# EAGLE design pcb-bldc-sensorless (EAGLE 9.6.2)
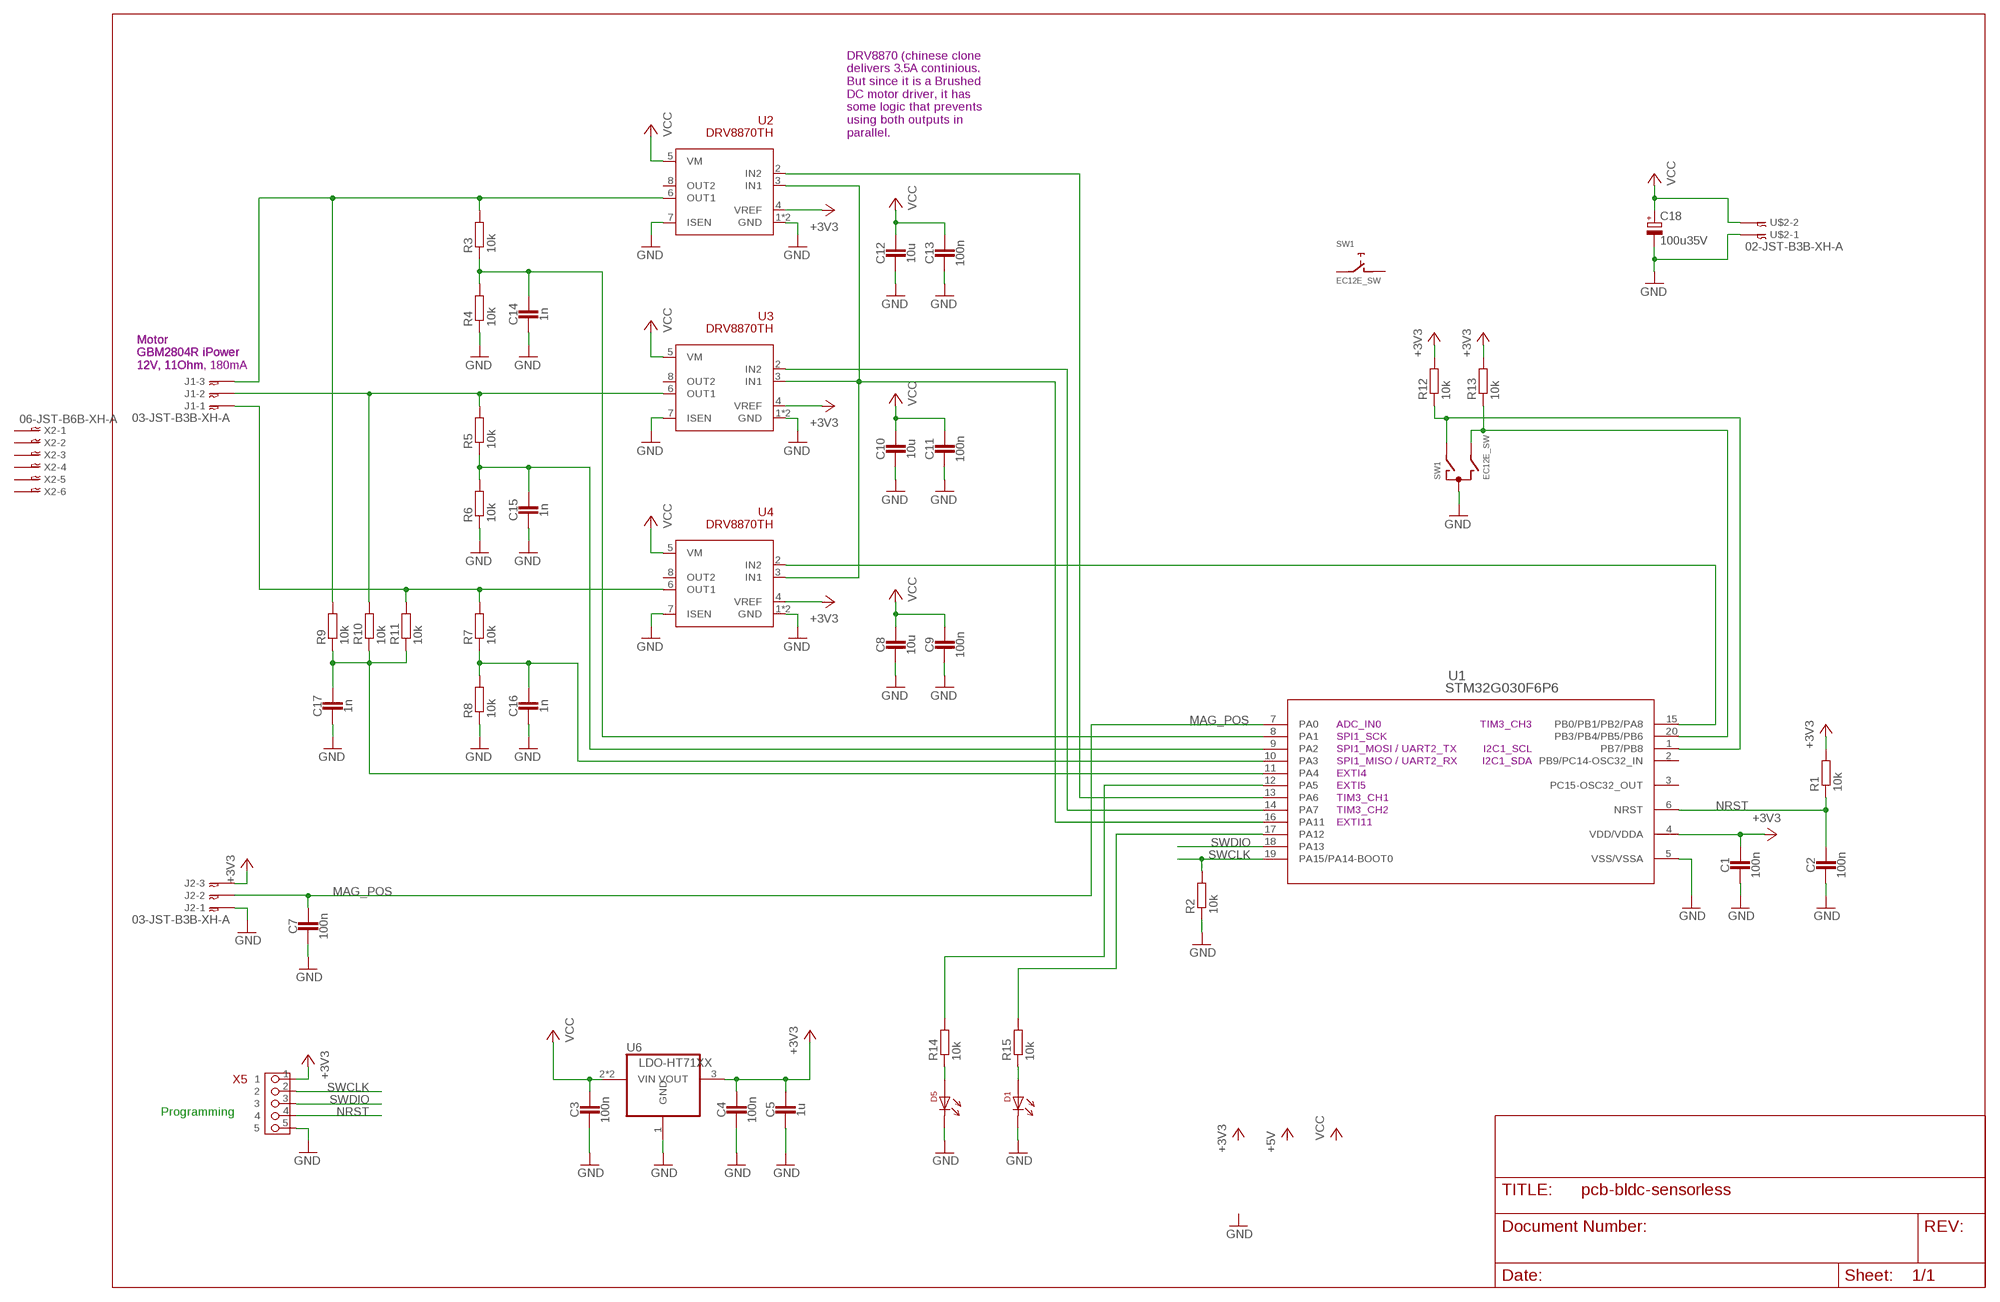
[diagram p0: schematic, sheet 1]

## Parts
C1  100n  CAPACITOR0603_CAP  [0603_CAP]
C2  100n  CAPACITOR0603_CAP  [0603_CAP]
C3  100n  CAPACITOR0603_CAP  [0603_CAP]
C4  100n  CAPACITOR0603_CAP  [0603_CAP]
C5  1u  CAPACITOR0603_CAP  [0603_CAP]
C7  100n  CAPACITOR0603_CAP  [0603_CAP]
C8  10u  CAPACITOR1206_CAP  [1206_CAP]
C9  100n  CAPACITOR0603_CAP  [0603_CAP]
C10  10u  CAPACITOR1206_CAP  [1206_CAP]
C11  100n  CAPACITOR0603_CAP  [0603_CAP]
C12  10u  CAPACITOR1206_CAP  [1206_CAP]
C13  100n  CAPACITOR0603_CAP  [0603_CAP]
C14  1n  CAPACITOR0603_CAP  [0603_CAP]
C15  1n  CAPACITOR0603_CAP  [0603_CAP]
C16  1n  CAPACITOR0603_CAP  [0603_CAP]
C17  1n  CAPACITOR0603_CAP  [0603_CAP]
C18  100u35V  CPOL-EU153CLV-0605  [153CLV-0605]
D1  LED-0805  [0805-DOT]
D5  LED-0805  [0805-DOT]
J1  03-JST-B3B-XH-A  [B3B-XH]
J2  03-JST-B3B-XH-A  [B3B-XH]
R1  10k  RESISTOR0603_RES  [0603-RES]
R2  10k  RESISTOR0603_RES  [0603-RES]
R3  10k  RESISTOR0603_RES  [0603-RES]
R4  10k  RESISTOR0603_RES  [0603-RES]
R5  10k  RESISTOR0603_RES  [0603-RES]
R6  10k  RESISTOR0603_RES  [0603-RES]
R7  10k  RESISTOR0603_RES  [0603-RES]
R8  10k  RESISTOR0603_RES  [0603-RES]
R9  10k  RESISTOR0603_RES  [0603-RES]
R10  10k  RESISTOR0603_RES  [0603-RES]
R11  10k  RESISTOR0603_RES  [0603-RES]
R12  10k  RESISTOR0603_RES  [0603-RES]
R13  10k  RESISTOR0603_RES  [0603-RES]
R14  10k  RESISTOR0603_RES  [0603-RES]
R15  10k  RESISTOR0603_RES  [0603-RES]
SW1  EC12E_SW  [ALPS_EC12E_SW]
U1  STM32G030F6P6  [TSSOP20]
U2  DRV8870TH  [SOIC-8-THERM]
U3  DRV8870TH  [SOIC-8-THERM]
U4  DRV8870TH  [SOIC-8-THERM]
U6  LDO-HT71XX  [SOT-89]
U$2  02-JST-B3B-XH-A  [B2B-XH]
X2  06-JST-B6B-XH-A  [B6B-XH]
X5  PIN_5X1HD  [PIN_5X1_HD]

## Nets
+3V3: C1.1 C4.1 C5.1 J2.P$3 R1.2 R12.2 R13.2 U1.4(VDD/VDDA) U2.4(VREF) U3.4(VREF) U4.4(VREF) U6.3(VOUT) X5.1
GND: C1.2 C2.2 C3.2 C4.2 C5.2 C7.2 C8.2 C9.2 C10.2 C11.2 C12.2 C13.2 C14.2 C15.2 C16.2 C17.2 C18.- D1.2 D5.2 J2.P$1 R2.1 R4.1 R6.1 R8.1 SW1.C U1.5(VSS/VSSA) U2.1(GND) U2.7(ISEN) U2.9(GND) U3.1(GND) U3.7(ISEN) U3.9(GND) U4.1(GND) U4.7(ISEN) U4.9(GND) U6.1(GND) U$2.P$1 X5.5
MAG_POS: C7.1 J2.P$2 U1.7(PA0)
N$1: U1.16(PA11) U2.3(IN1) U3.3(IN1) U4.3(IN1)
N$2: C14.1 R3.1 R4.2 U1.8(PA1)
N$3: J1.P$2 R5.2 R10.2 U3.6(OUT1)
N$4: J1.P$3 R3.2 R9.2 U2.6(OUT1)
N$5: U1.13(PA6) U2.2(IN2)
N$6: U1.14(PA7) U3.2(IN2)
N$7: J1.P$1 R7.2 R11.2 U4.6(OUT1)
N$8: C15.1 R5.1 R6.2 U1.9(PA2)
N$9: U1.15(PB0/PB1/PB2/PA8) U4.2(IN2)
N$10: C16.1 R7.1 R8.2 U1.10(PA3)
N$11: C17.1 R9.1 R10.1 R11.1 U1.11(PA4)
N$12: R12.1 SW1.A U1.1(PB7/PB8)
N$13: R13.1 SW1.B U1.20(PB3/PB4/PB5/PB6)
N$14: D1.1 R15.1
N$15: R14.2 U1.12(PA5)
N$16: R15.2 U1.17(PA12)
N$19: D5.1 R14.1
NRST: C2.1 R1.1 U1.6(NRST) X5.4
SWCLK: R2.2 U1.19(PA15/PA14-BOOT0) X5.2
SWDIO: U1.18(PA13) X5.3
VCC: C3.1 C8.1 C9.1 C10.1 C11.1 C12.1 C13.1 C18.+ U2.5(VM) U3.5(VM) U4.5(VM) U6.2(VIN) U6.2@1(VIN) U$2.P$2
Unconnected: SW1.D SW1.E SW1.GND1(G) SW1.GND2(G) U1.2(PB9/PC14-OSC32_IN) U1.3(PC15-OSC32_OUT) U2.8(OUT2) U3.8(OUT2) U4.8(OUT2) X2.P$1 X2.P$2 X2.P$3 X2.P$4 X2.P$5 X2.P$6

## Notes on the sheet
- DRV8870 (chinese clone
  delivers 3.5A continious.
  But since it is a Brushed
  DC motor driver, it has
  some logic that prevents
  using both outputs in 
  parallel.
- Motor
  GBM2804R iPower
  12V, 11Ohm
- Motor
  GBM2804R iPower
  12V, 11Ohm, 180mA
- ADC_IN0 | TIM3_CH3
- SPI1_SCK
- SPI1_MOSI / UART2_TX | I2C1_SCL
- SPI1_MISO / UART2_RX | I2C1_SDA
- EXTI4
- EXTI5
- TIM3_CH1
- TIM3_CH2
- EXTI11
- Programming

## Library data of the parts
C1-C5 C7-C17 = passives:CAPACITOR: SMD Capacitor
C18 = resistor:CPOL-EU: POLARIZED CAPACITOR, European symbol
D1 D5 = ftobler:LED
J1 J2 = bt_con-jst-xh:03-JST: JST CONNECTOR
R1-R15 = passives:RESISTOR: Resistor Basic schematic elements and footprints for 0201, 0402, 0603, 1206, and PTH resistors.
SW1 = switch-alps:EC12E_SW: ALPS rotary Encoder EC12E series with switch; MPN: EC12E2424407; OC_FARNELL: 1520813; OC_NEWARK: 74M1068
U1 = stm32:STM32G030F6P6; COPYRIGHT: Copyright (C) 2024 Ultra Librarian. All rights reserved.; MANUFACTURER_PART_NUMBER: STM32G030F6P6; MFR_NAME: STMicroelectronics
U2-U4 = ftobler:DRV8870
U6 = ftobler:LDO
U$2 = bt_con-jst-xh:02-JST: JST CONNECTOR
X2 = bt_con-jst-xh:06-JST: JST CONNECTOR
X5 = ftobler-conn:PIN_5X1

## Board
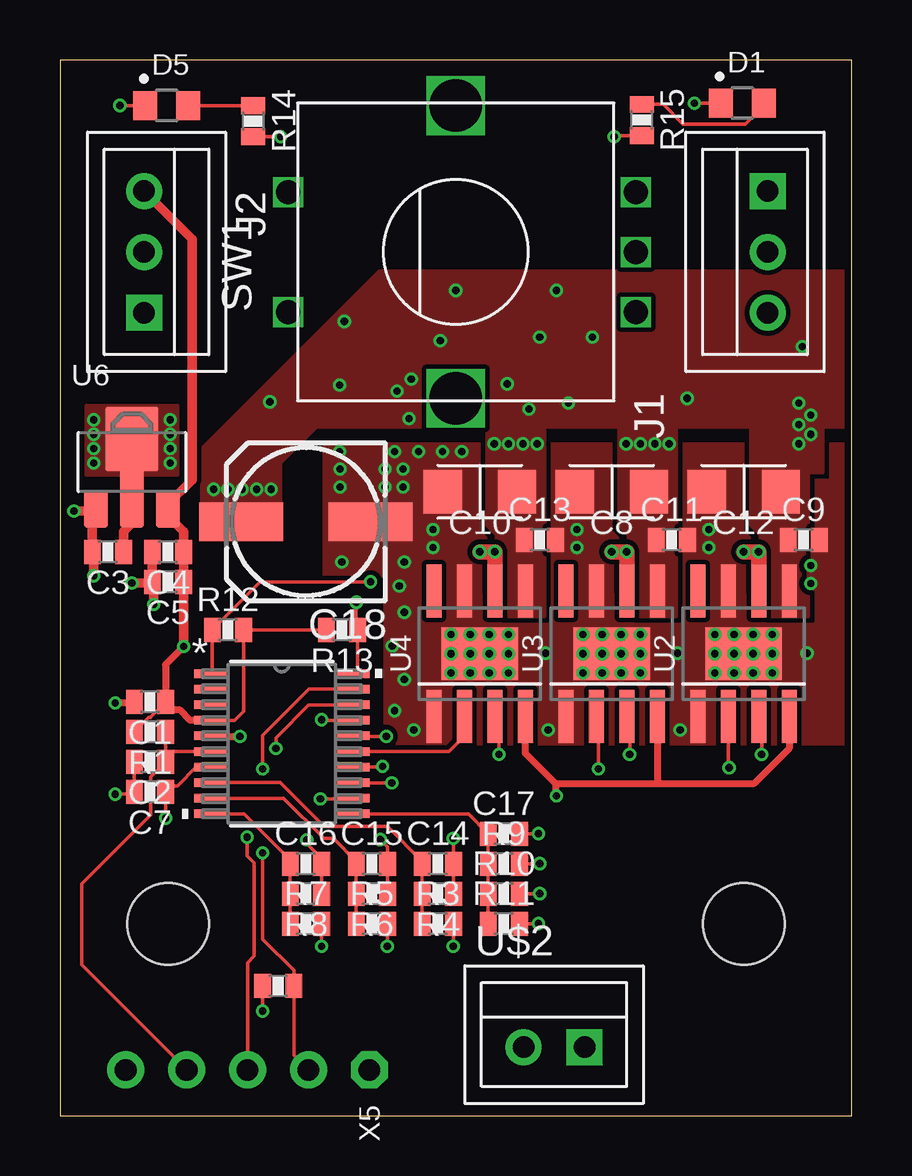
[diagram p1: board, top side]
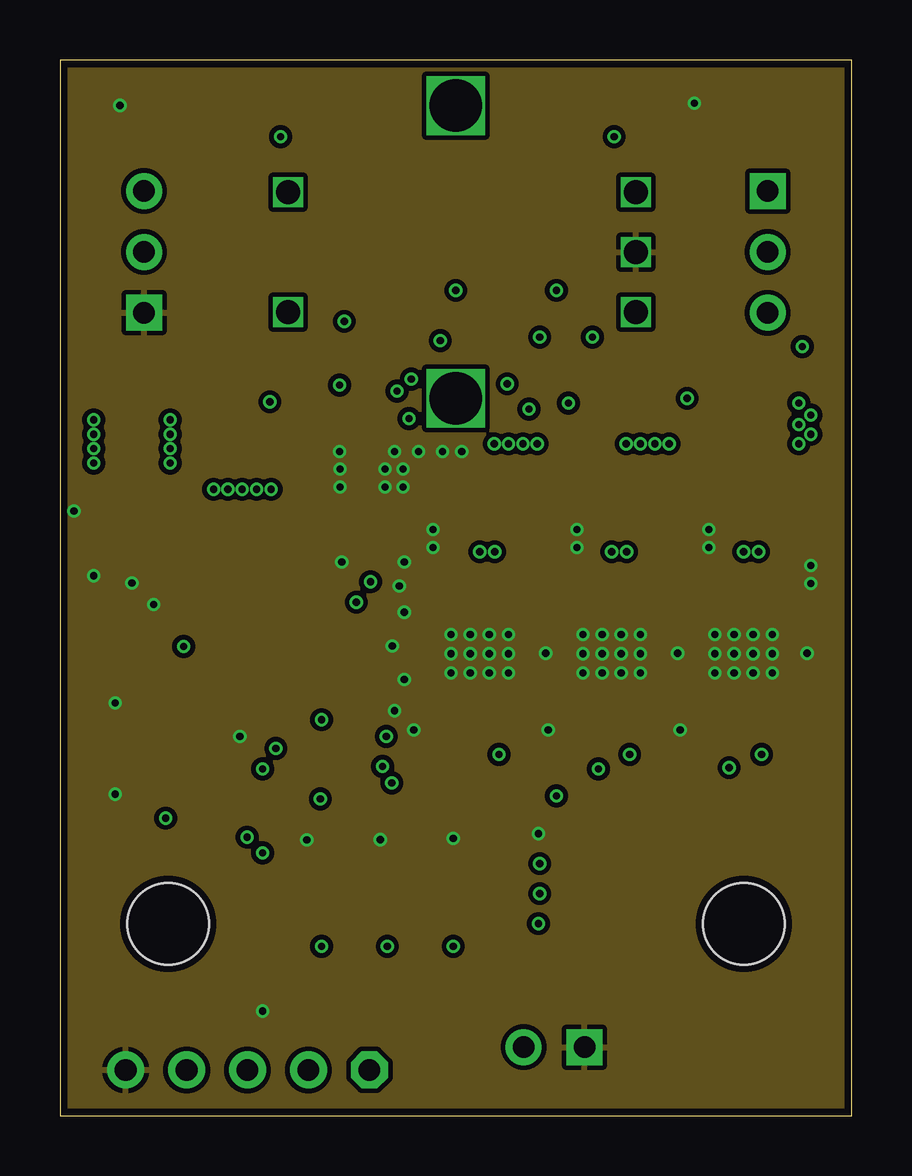
[diagram p2: board, inner layer Route2]
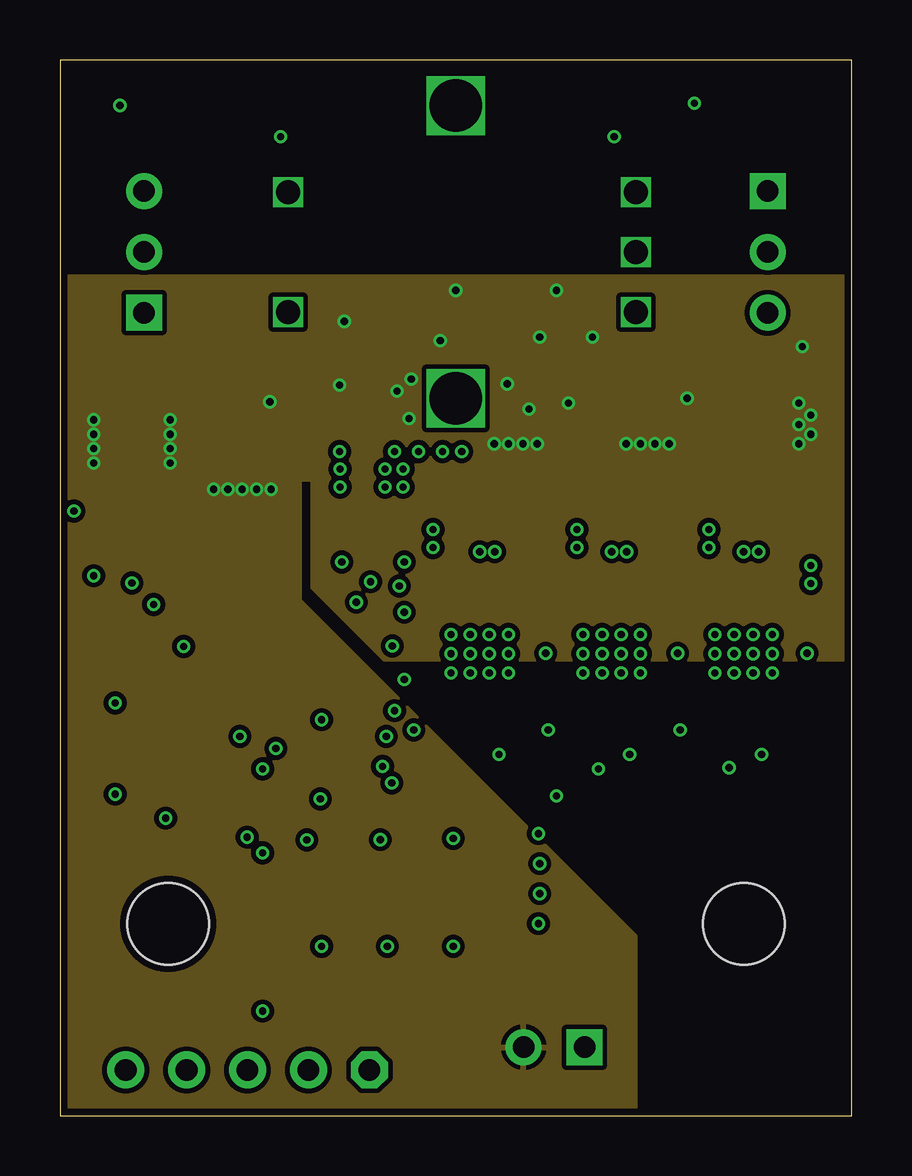
[diagram p3: board, inner layer Route15]
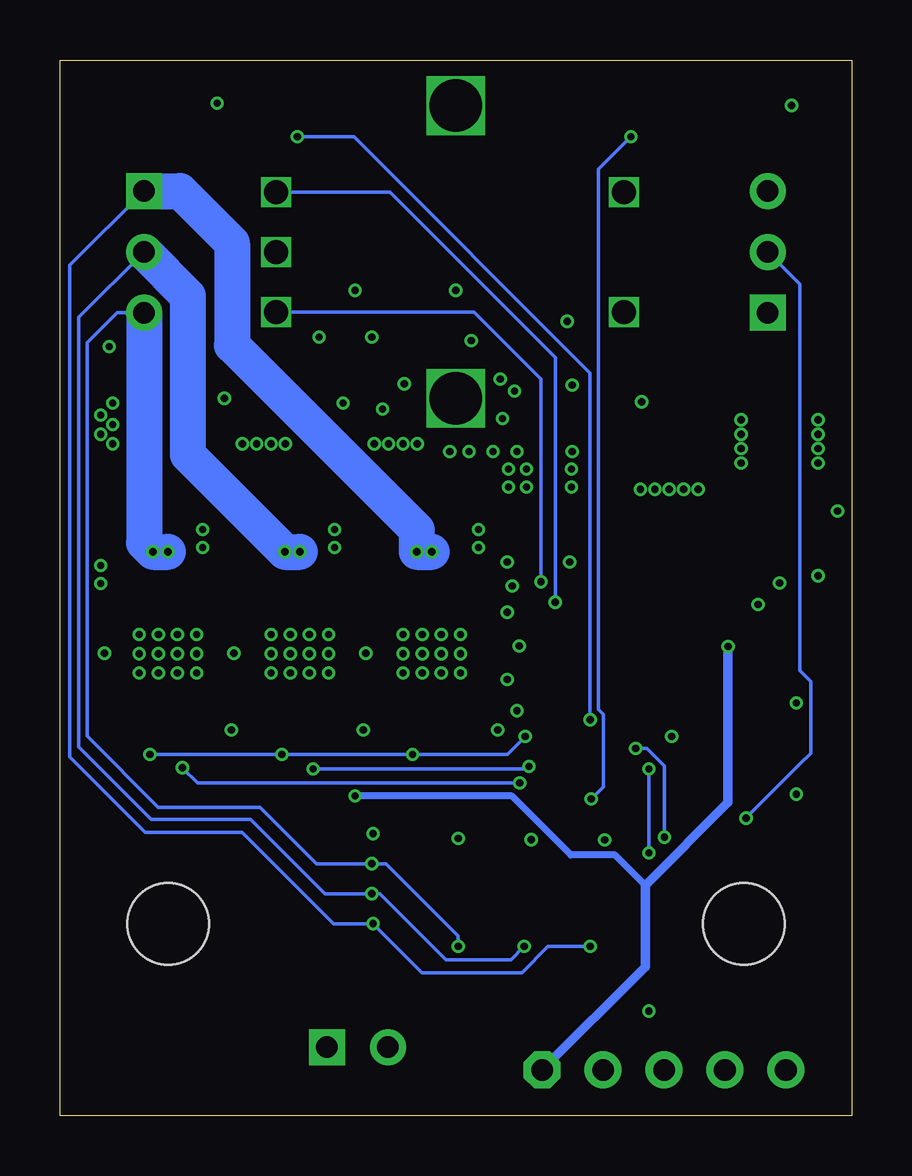
[diagram p4: board, bottom side, seen from below]

Size 33 x 44 mm. Coordinates in mm from the lower left corner, seen from the top.
Outline: 0,0 33,0 33,44 0,44 0,0
Copper layers (1+2*15+16): Top 0.035mm / dielectric 0.2mm / Route2 0.035mm / dielectric 0.4mm / Route15 0.035mm / dielectric 0.2mm / Bottom 0.035mm
Design rules "default *": minimum track width 0.15mm, minimum drill 0.2mm, track to track 0.2mm, track to pad 0.2mm, pad to pad 0.2mm, via to via 0.2mm, smd to smd 0.2mm, copper to edge 0.3mm, drill to drill 10mil, minimum pad ring 0.125mm, minimum via ring 0.125mm, stop-mask expansion 0.05mm, vias tented up to drill 0.35mm, thermal gap 0.2mm
Holes 3.4 mm at 4.5,8 28.5,8
tRestrict: area 25.2,4.7 to 31.8,11.3; area 1.2,4.7 to 7.8,11.3
bRestrict: area 25.2,4.7 to 31.8,11.3; area 1.2,4.7 to 7.8,11.3

### Footprints (pad centres in the part's own frame; a part is rotated, then mirrored left to right if it is on the bottom)
0603_CAP = smd 0.7 x 1: 1 -0.65,0; 2 0.65,0
1206_CAP = smd 1.6 x 1.8: 1 -1.55,0; 2 1.55,0
153CLV-0605 = smd 3.5 x 1.6: + 2.7,0; - -2.7,0
0805-DOT = smd 1 x 1.2: 1 0.9,0; 2 -0.9,0
B3B-XH = drill 0.9 pad 1.5 square: P$1 2.54,0 | drill 0.9 pad 1.5: P$2 0,0; P$3 -2.54,0
0603-RES = smd 0.7 x 1: 1 -0.65,0; 2 0.65,0
ALPS_EC12E_SW = drill 1 square: A -2.5,-7.5; B 2.5,-7.5; C 0,-7.5; D -2.5,7; E 2.5,7 | drill 2.2 square: GND1 -6.1,0; GND2 6.1,0
TSSOP20 = smd 1.462 x 0.355: 1 -2.921,2.925; 2 -2.921,2.275; 3 -2.921,1.625; 4 -2.921,0.975; 5 -2.921,0.325; 6 -2.921,-0.325; 7 -2.921,-0.975; 8 -2.921,-1.625; 9 -2.921,-2.275; 10 -2.921,-2.925; 11 2.921,-2.925; 12 2.921,-2.275; 13 2.921,-1.625; 14 2.921,-0.975; 15 2.921,-0.325; 16 2.921,0.325; 17 2.921,0.975; 18 2.921,1.625; 19 2.921,2.275; 20 2.921,2.925
SOIC-8-THERM = smd 0.61 x 2.21: 1 -1.905,-2.616; 2 -0.635,-2.616; 3 0.635,-2.616; 4 1.905,-2.616; 5 1.905,2.616; 6 0.635,2.616; 7 -0.635,2.616; 8 -1.905,2.616 | smd 3.2 x 2.2: 9 0,0
SOT-89 = smd 1 x 1.5: 1 -1.499,-1.981; 3 1.499,-1.981 | smd 1 x 2.5: 2 0,-1.477 | smd 2.2 x 2.7: 2@1 0,0.94
B2B-XH = drill 0.9 pad 1.5 square: P$1 1.27,0 | drill 0.9 pad 1.5: P$2 -1.27,0
B6B-XH = drill 0.9 pad 1.5 square: P$1 6.35,0 | drill 0.9 pad 1.5: P$2 3.81,0; P$3 1.27,0; P$4 -1.27,0; P$5 -3.81,0; P$6 -6.35,0
PIN_5X1_HD = drill 0.9 pad 1.54 octagon: 1 0,0 | drill 0.9 pad 1.54: 2 0,-2.54; 3 0,-5.08; 4 0,-7.62; 5 0,-10.16

### Placement (x,y rotation side)
C1  3.75,17.25 180 top
C2  3.75,14.75 180 top
C3  2,23.5 180 top
C4  4.5,23.5 180 top
C5  4.5,22.25 180 top
C7  3.75,13.5 180 top
C8  23,26 180 top
C9  31,24 0 top
C10  17.5,26 180 top
C11  25.5,24 0 top
C12  28.5,26 180 top
C13  20,24 0 top
C14  15.75,10.5 0 top
C15  13,10.5 0 top
C16  10.25,10.5 0 top
C17  18.5,11.75 0 top
C18  10.25,24.75 180 top
D1  28.45,42.2 0 top
D5  4.45,42.1 0 top
J1  29.5,36 90 top
J2  3.5,36 270 top
R1  3.75,16 180 top
R2  9.1,5.4 0 top
R3  15.75,8 0 top
R4  15.75,9.25 180 top
R5  13,8 0 top
R6  13,9.25 180 top
R7  10.25,8 0 top
R8  10.25,9.25 180 top
R9  18.5,10.5 0 top
R10  18.5,9.25 0 top
R11  18.5,8 0 top
R12  7,20.25 0 top
R13  11.75,20.25 180 top
R14  8.05,41.45 270 top
R15  24.25,41.5 270 top
SW1  16.5,36 90 top
U1  9.25,15.5 0 top
U2  28.5,19.25 0 top
U3  23,19.25 0 top
U4  17.5,19.25 0 top
U6  3,27.25 0 top
U$2  20.6,2.85 0 top
X2  2,-43.25 0 top  (outside the outline)
X5  12.9,1.9 270 top

### Tracks (layer width: path | path; a pad name or v marks a point on that pad's centre or on a via)
+3V3  (via drill 0.3)
  Top 0.15: R1.2 3.7,16.6 3.77,16.6 3.77,16.61 4.26,17.1 4.4,17.1 | R13.2 R12.2 7.65,16.85 7.28,16.48 U1.4
  Top 0.3: v5.15,19.55 4.4,18.8 C1.1 4.4,17.1 4.6,16.9 5,16.9 5.42,16.48 U1.4 | U2.4 30.41,15.3 28.93,13.82 24.9,13.82 | U4.4 19.41,15.1 20.68,13.82 | 24.9,13.82 20.68,13.82 | U3.4 24.91,13.83 24.9,13.82 | v20.7,13.32 20.68,13.35 20.68,13.82
  Top 0.4: J2.P$3 5.5,36.54 5.5,26.5 4.5,25.5 U6.3 4.5,25 5.15,24.35 C4.1 C5.1 v5.15,19.55
  Bottom 0.3: v20.7,13.32 14.16,13.32 11.71,10.86 9.86,10.86 8.6,9.6
  Bottom 0.4: X5.1 8.6,6.2 8.6,9.6 5.15,13.05 v5.15,19.55
GND  (via drill 0.3, 0.3 pad 0.45)
  Top 0.15: C17.2 v19.95,11.75 | R8.1 C16.2 10.9,10.73 10.29,11.34 v10.29,11.49 | R6.1 C15.2 13.65,11.2 v13.35,11.5 | R4.1 C14.2 v16.4,11.55 | R2.1 v8.45,4.35 | D5.2 v2.5,42.1 | D1.2 v26.45,42.2 | C2.2 C7.2 3,13.4 v2.3,13.4
  Top 0.3: C1.2 3.05,17.2 v2.3,17.2 | U1.5 6.35,15.8 v7.5,15.8
  Top 0.4: v1.4,22.5 1.4,23.45 C3.2 1.35,25.12 U6.1 1.43,25.2 v0.58,25.2 | C5.2 3.9,22.2 v3.9,21.3 | C4.2 C5.2 | C5.2 3.8,22.2 v3,22.2
  other vias: 17.9,19.25 17.1,19.25 17.9,18.45 17.1,18.45 16.3,18.45 16.3,19.25 16.3,20.05 17.1,20.05 17.9,20.05 18.7,20.05 18.7,19.25 18.7,18.45 23.4,19.25 22.6,19.25 23.4,18.45 22.6,18.45 21.8,18.45 21.8,19.25 21.8,20.05 22.6,20.05 23.4,20.05 24.2,20.05 24.2,19.25 24.2,18.45 28.9,19.25 28.1,19.25 28.9,18.45 28.1,18.45 27.3,18.45 27.3,19.25 27.3,20.05 28.1,20.05 28.9,20.05 29.7,20.05 29.7,19.25 29.7,18.45 14.3,26.2 14.3,26.95 13.55,26.95 13.55,26.2 11.68,26.2 11.68,26.95 15.55,24.43 15.55,23.68 21.55,24.43 21.55,23.68 27.05,24.43 27.05,23.68 31.3,22.93 31.3,22.18 15.95,27.68 16.75,27.68 14.95,27.68 13.95,27.68 11.65,27.68 11.75,23.07 14.35,23.07 14.75,16.07 20.35,16.07 25.85,16.07 13.95,16.88 14.35,18.18 13.85,19.57 14.35,20.98 14.15,22.07 20.25,19.27 25.75,19.27 31.15,19.27
  pour Route2: -1.2,45 34.35,45 34.35,-1.4 -1.2,-1.4
  pour Top (rank 2, no thermals): 11,28 33.5,28 33.5,15.5 13.55,15.5 13.55,22.5 11,22.5
MAG_POS  (via drill 0.3)
  Top 0.15: U1.7 5.67,14.53 4.9,13.75 4.4,13.75 C7.1 v4.4,12.4
  Bottom 0.15: J2.P$2 2.15,34.65 2.15,18.55 1.7,18.1 1.7,15.1 2.15,14.65 v4.4,12.4
N$1  (via drill 0.3)
  Top 0.15: U4.3 18.3,16.47 v18.3,15.05 | U3.3 23.75,16.52 v23.75,15.05 | U2.3 29.25,16.52 v29.25,15.05 | U1.16 12.2,15.8 v13.6,15.8
  Bottom 0.15: v29.25,15.05 v23.75,15.05 v18.3,15.05 14.35,15.05 v13.6,15.8
N$2
  Top 0.15: U1.8 9.18,13.88 11,12.05 13.65,12.05 15.1,10.6 C14.1 R4.2 R3.1
N$3  (via drill 0.3)
  Top 0.15: R5.2 v13.65,7.05 | R10.2 v20,9.25
  Top 0.65: U3.6 23.64,23.5 v23.62,23.5 v23,23.5
  Bottom 0.15: v13.65,7.05 14.2,6.5 16.9,6.5 19.65,9.25 v20,9.25 21.95,9.25 25.05,12.35 29.2,12.35 32.23,15.38 32.23,33.27 J1.P$2
  Bottom 1.5: J1.P$2 29.5,35.99 27.68,34.16 27.68,27.55 v23.62,23.5 v23,23.5
N$4  (via drill 0.3)
  Top 0.15: R3.2 v16.4,7.05 | R9.2 v20,10.5
  Top 0.65: U2.6 29.14,23.5 v29.12,23.5 v28.5,23.5
  Bottom 0.15: v16.4,7.05 16.4,7.5 19.4,10.5 v20,10.5 22.3,10.5 24.65,12.85 28.9,12.85 31.88,15.82 31.88,32.21 30.62,33.46 J1.P$3
  Bottom 1.5: v28.5,23.5 v29.12,23.5 29.5,23.88 J1.P$3
N$5  (via drill 0.3)
  Top 0.15: U1.13 v13.82,13.88 v13.83,13.87 | U2.2 27.86,14.54 v27.9,14.5
  Bottom 0.15: v13.83,13.87 27.27,13.87 v27.9,14.5
N$6  (via drill 0.3)
  Top 0.15: U1.14 13.43,14.53 v13.45,14.55 | U3.2 22.45,16.55 v22.45,14.45
  Bottom 0.15: v22.45,14.45 13.55,14.45 v13.45,14.55
N$7  (via drill 0.3)
  Top 0.15: R7.2 v10.9,7.05 | R11.2 v19.95,8
  Top 0.65: U4.6 18.14,23.5 v18.12,23.5 v17.5,23.5
  Bottom 0.15: v10.9,7.05 12.65,7.05 13.75,5.95 17.9,5.95 v19.95,8 21.6,8 25.4,11.8 29.45,11.8 32.6,14.95 32.6,35.44 J1.P$1
  Bottom 1.5: J1.P$1 27.99,38.54 25.82,36.38 25.82,32.11 18.12,24.41 v18.12,23.5 v17.5,23.5
N$8
  Top 0.15: U1.9 9.33,13.22 11.01,11.55 11.4,11.55 12.35,10.6 C15.1 R6.2 R5.1
N$9
  Top 0.15: U1.15 16.23,15.18 16.86,15.81 U4.2
N$10
  Top 0.15: U1.10 7.67,12.57 9.6,10.65 C16.1 R8.2 R7.1
N$11
  Top 0.15: U1.11 17.02,12.57 C17.1 R9.1 R10.1 R11.1
N$12  (via drill 0.3)
  Top 0.15: U1.1 6.35,18.45 R12.1 8.35,22.25 v12.95,22.25
  Bottom 0.15: v12.95,22.25 12.95,30.7 15.75,33.5 SW1.A
N$13  (via drill 0.3)
  Top 0.15: U1.20 12.2,18.4 12.4,18.4 R13.1 12.35,20.3 v12.35,21.4
  Bottom 0.15: SW1.B 19.25,38.5 12.35,31.6 v12.35,21.4
N$14
  Top 0.15: R15.1 25.15,42.15 25.98,41.33 28.57,41.33 29.35,42.1 D1.1
N$15  (via drill 0.3)
  Top 0.15: U1.12 12.15,13.2 v10.85,13.2 | R14.2 v9.2,40.8
  Bottom 0.15: v9.2,40.8 10.55,39.45 10.55,16.93 10.35,16.73 10.35,13.7 v10.85,13.2
N$16  (via drill 0.3)
  Top 0.15: U1.17 10.93,16.48 v10.9,16.5 | v23.1,40.8 23.15,40.85 R15.2
  Bottom 0.15: v10.9,16.5 10.9,30.95 20.75,40.8 v23.1,40.8
N$19
  Top 0.15: D5.1 R14.1
NRST
  Top 0.15: R1.1 C2.1 | U1.6 4.4,15.18 C2.1 | X5.4 0.9,6.28 0.9,9.65 3.77,12.53 3.77,14.12 C2.1
SWCLK  (via drill 0.3)
  Top 0.15: X5.2 9.75,2.51 R2.2 9.75,6.05 8.45,7.35 v8.45,10.95 | v8.45,14.45 8.45,15.85 10.38,17.77 U1.19
  Bottom 0.15: v8.45,10.95 v8.45,14.45
SWDIO  (via drill 0.3)
  Top 0.15: X5.3 7.82,6.37 8.1,6.65 8.1,10.52 7.8,10.82 v7.8,11.6 | U1.18 10.38,17.12 9,15.75 v9,15.3
  Bottom 0.15: v7.8,11.6 7.8,14.58 8.52,15.3 v9,15.3
VCC  (via drill 0.3)
  Top 0.4: C3.1 2.65,24.35 3,24.7 U6.2
  other vias: 8.2,26.1 18.1,28 18.7,28 19.3,28 19.9,28 23.6,28 24.2,28 24.8,28 25.4,28 31.3,29.2 30.8,28.8 30.8,28 31.3,28.4 30.8,29.7 6.4,26.1 7,26.1 7.6,26.1 8.8,26.1 4.6,27.2 4.6,27.8 4.6,28.4 4.6,29 1.4,27.2 1.4,27.8 1.4,28.4 1.4,29 8.75,29.75 14.05,30.2 14.55,29.05 14.65,30.7 15.85,32.3 16.5,34.4 20.7,34.4 26.15,29.9 30.95,32.05 22.2,32.45 21.2,29.7 20,32.45 18.65,30.5 19.55,29.45 11.65,30.45 11.85,33.1
  pour Top (no thermals): 17.8,28.8 17.8,24.6 18.2,24.2 18.2,20.8 20.2,20.8 20.2,28.8
  pour Top (no thermals): 23.3,28.8 23.3,24.6 23.7,24.2 23.7,20.8 25.7,20.8 25.7,28.8
  pour Top (no thermals): 28.8,29.9 28.8,24.6 29.2,24.2 29.2,20.8 31.2,20.8 31.2,29.9
  pour Top (no thermals): 29.7,29.9 29.7,26.8 31.8,26.8 31.8,29.9
  pour Top (no thermals): 1.1,29.6 1.1,26.7 4.9,26.7 4.9,29.6
  pour Top (rank 3, no thermals): 9.2,24.1 9.2,27.2 10.7,28.7 33.3,28.7 33.3,35.2 13.3,35.2 5.9,27.8 5.9,24.6 6.4,24.1
  pour Route15: -0.5,-0.5 24,-0.5 24,7.5 10,21.5 10,27 -0.5,27
  pour Route15: 34.5,19 13.5,19 10.5,22 10.5,26.5 -0.5,26.5 -0.5,35 34.5,35

### Text on the board
tStop: GND | D4 | D5
tFinish: JLCJLCJLCJLC | G | R | D | C | 3 | VCC | GND
bFinish: pcb-bldc-sensorless v1 / by ftobler 2024